# EAGLE design Kintex7_disp_out_hdmi (EAGLE 7.6.0)
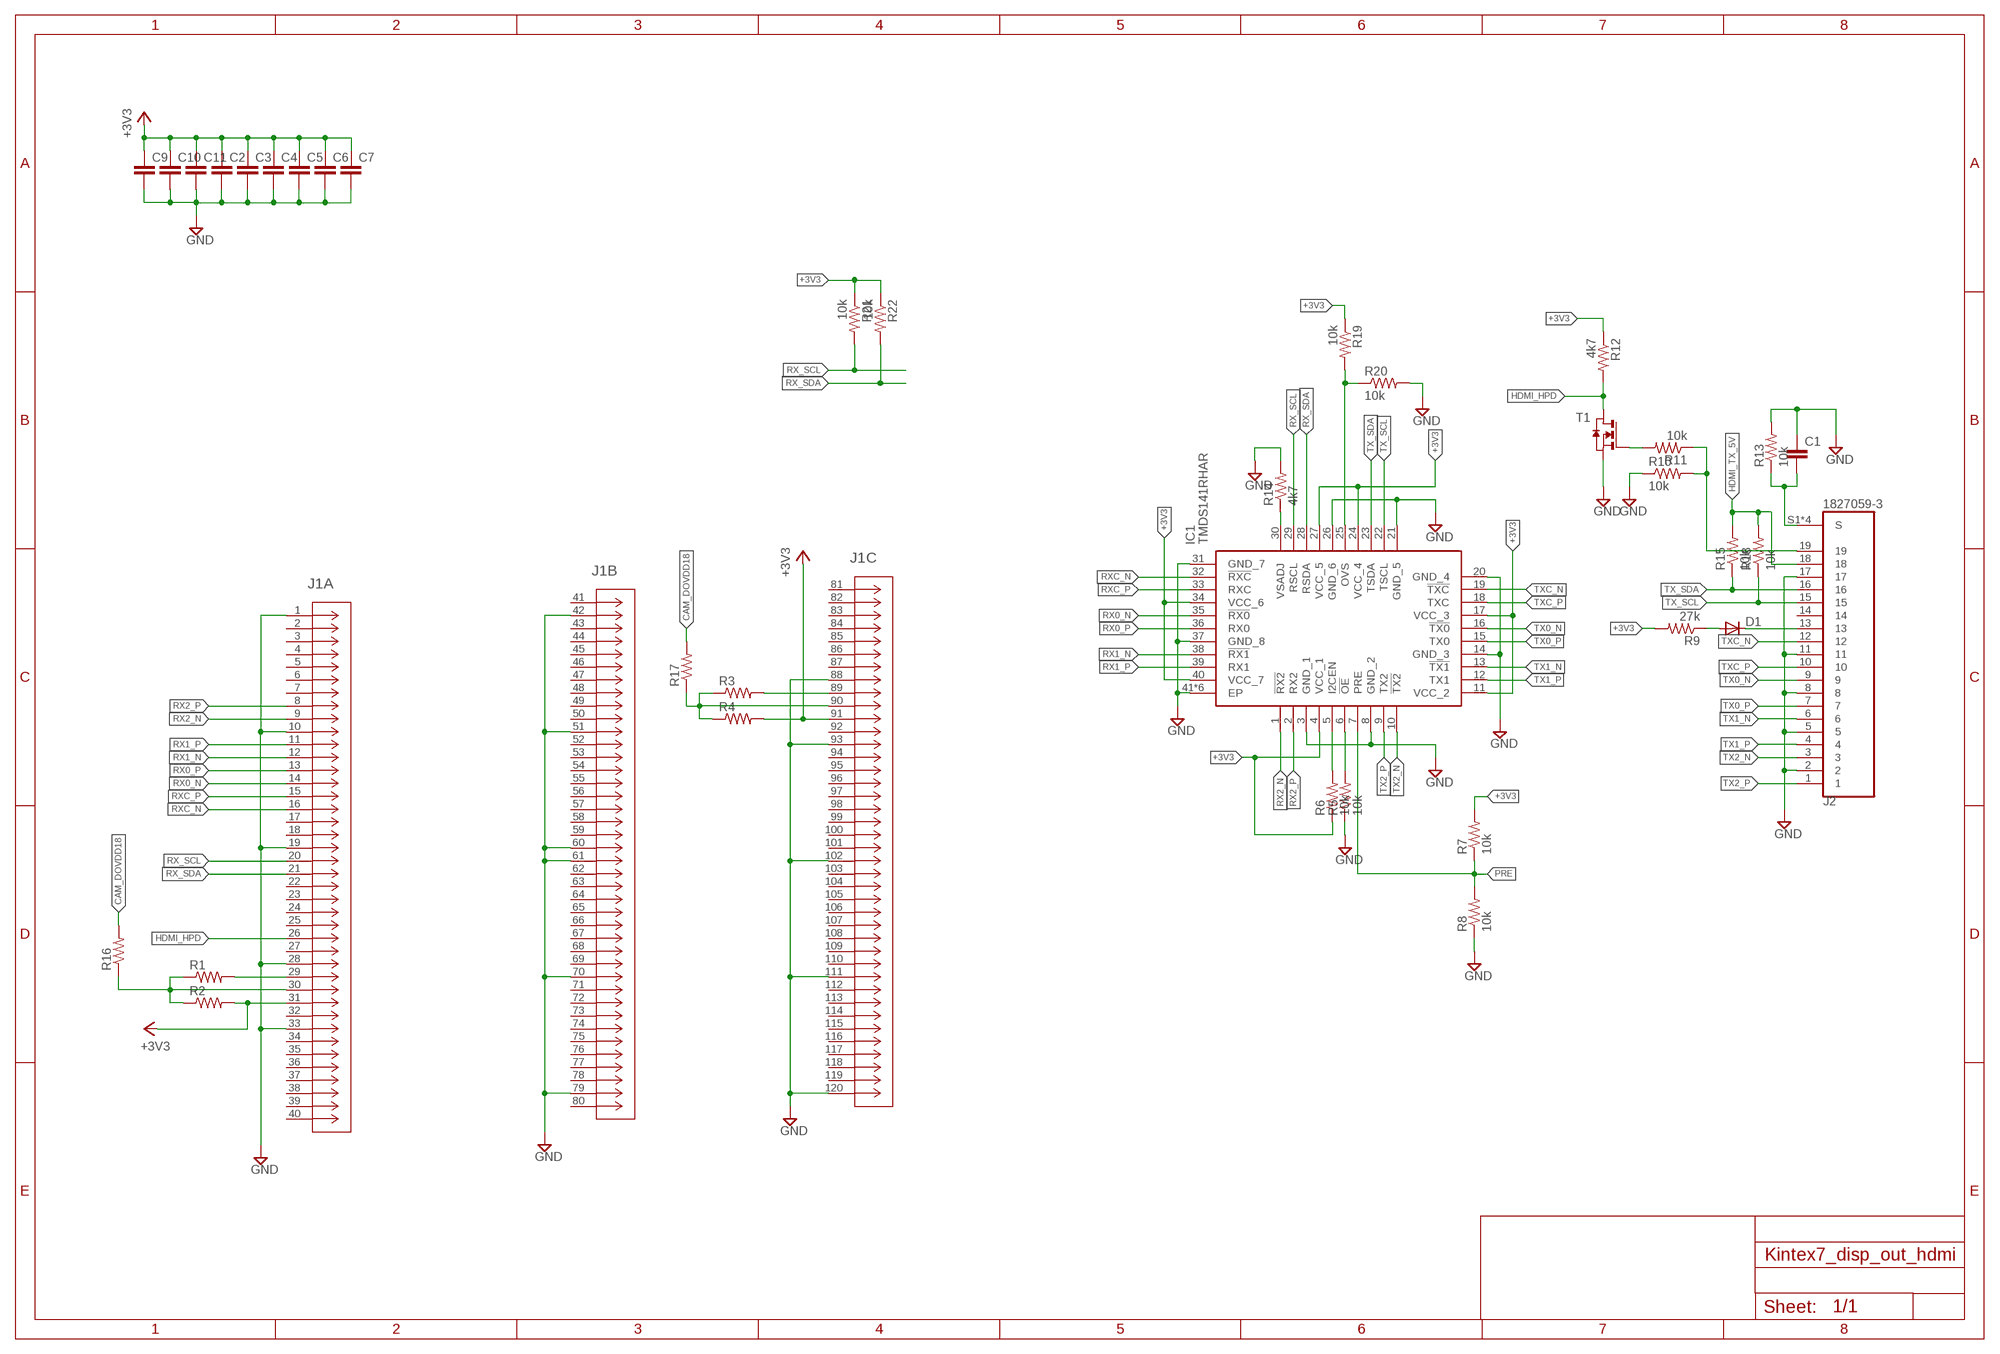
[diagram p0: schematic, sheet 1]

## Parts
C1  C-EUC0603  [C0603]
C2  C-EUC0603  [C0603]
C3  C-EUC0603  [C0603]
C4  C-EUC0603  [C0603]
C5  C-EUC0603  [C0603]
C6  C-EUC0603  [C0603]
C7  C-EUC0603  [C0603]
C9  C-EUC0603  [C0603]
C10  C-EUC0603  [C0603]
C11  C-EUC0603  [C0603]
D1  DIODE-MINIMELF  [MINIMELF]
IC1  TMDS141RHAR  [QFN50P600X600X100-41N]
J1  5177985-5  [CONN_5177985-5]
J2  1827059-3  [TE_1827059-3]
R1  R-US_R0805  [R0805]
R2  R-US_R0805  [R0805]
R3  R-US_R0805  [R0805]
R4  R-US_R0805  [R0805]
R5  10k  R-US_R0805  [R0805]
R6  10k  R-US_R0805  [R0805]
R7  10k  R-US_R0805  [R0805]
R8  10k  R-US_R0805  [R0805]
R9  27k  R-US_R0805  [R0805]
R10  10k  R-US_R0805  [R0805]
R11  10k  R-US_R0805  [R0805]
R12  4k7  R-US_R0805  [R0805]
R13  10k  R-US_R0805  [R0805]
R14  4k7  R-US_R0805  [R0805]
R15  10k  R-US_R0805  [R0805]
R16  R-US_R0805  [R0805]
R17  R-US_R0805  [R0805]
R18  10k  R-US_R0805  [R0805]
R19  10k  R-US_R0805  [R0805]
R20  10k  R-US_R0805  [R0805]
R21  10k  R-US_R0805  [R0805]
R22  10k  R-US_R0805  [R0805]
T1  NMOSSOT23  [SOT-23]

## Nets
+3V3: C2.1 C3.1 C4.1 C5.1 C6.1 C7.1 C9.1 C10.1 C11.1 IC1.4(VCC_1) IC1.11(VCC_2) IC1.17(VCC_3) IC1.24(VCC_4) IC1.27(VCC_5) IC1.34(VCC_6) IC1.40(VCC_7) J1.31 J1.91 R2.2 R4.2 R6.1 R7.2 R9.2 R12.1 R19.1 R21.1 R22.1
CAM_DOVDD18: R16.2 R17.2
GND: C1.1 C2.2 C3.2 C4.2 C5.2 C6.2 C7.2 C9.2 C10.2 C11.2 IC1.3(GND_1) IC1.8(GND_2) IC1.14(GND_3) IC1.20(GND_4) IC1.21(GND_5) IC1.26(GND_6) IC1.31(GND_7) IC1.37(GND_8) IC1.41(EP) IC1.P$1(EP) IC1.P$2(EP) IC1.P$3(EP) IC1.P$4(EP) IC1.P$5(EP) J1.1 J1.10 J1.19 J1.28 J1.33 J1.42 J1.51 J1.60 J1.61 J1.70 J1.79 J1.88 J1.93 J1.102 J1.111 J1.120 J2.2 J2.5 J2.8 J2.11 J2.17 R5.1 R8.1 R10.1 R13.2 R14.2 R20.2 T1.2(S)
HDMI_HPD: J1.26 R12.2 T1.1(D)
HDMI_TX_5V: J2.18 R15.2 R18.2
N$1: D1.A R9.1
N$2: J1.90 R3.1 R4.1 R17.1
N$3: J1.29 R1.2
N$4: J1.89 R3.2
N$6: IC1.6(!OE) R5.2
N$7: IC1.5(I2CEN) R6.2
N$8: D1.C J2.13
N$9: J1.30 R1.1 R2.1 R16.1
N$10: IC1.25(OVS) R19.2 R20.1
N$12: R11.2 T1.3(G)
N$13: C1.2 J2.S1(S) J2.S2(S) J2.S3(S) J2.S4(S) R13.1
N$14: IC1.30(VSADJ) R14.1
N$15: J2.19 R10.2 R11.1
PRE: IC1.7(PRE) R7.1 R8.2
RX0_N: IC1.35(!RX0) J1.14
RX0_P: IC1.36(RX0) J1.13
RX1_N: IC1.38(!RX1) J1.12
RX1_P: IC1.39(RX1) J1.11
RX2_N: IC1.1(!RX2) J1.9
RX2_P: IC1.2(RX2) J1.8
RX_SCL: IC1.29(RSCL) J1.20 R21.2
RX_SDA: IC1.28(RSDA) J1.21 R22.2
RXC_N: IC1.32(!RXC) J1.16
RXC_P: IC1.33(RXC) J1.15
TX0_N: IC1.16(!TX0) J2.9
TX0_P: IC1.15(TX0) J2.7
TX1_N: IC1.13(!TX1) J2.6
TX1_P: IC1.12(TX1) J2.4
TX2_N: IC1.10(!TX2) J2.3
TX2_P: IC1.9(TX2) J2.1
TX_SCL: IC1.22(TSCL) J2.15 R18.1
TX_SDA: IC1.23(TSDA) J2.16 R15.1
TXC_N: IC1.19(!TXC) J2.12
TXC_P: IC1.18(TXC) J2.10
Unconnected: J1.2 J1.3 J1.4 J1.5 J1.6 J1.7 J1.17 J1.18 J1.22 J1.23 J1.24 J1.25 J1.27 J1.32 J1.34 J1.35 J1.36 J1.37 J1.38 J1.39 J1.40 J1.41 J1.43 J1.44 J1.45 J1.46 J1.47 J1.48 J1.49 J1.50 J1.52 J1.53 J1.54 J1.55 J1.56 J1.57 J1.58 J1.59 J1.62 J1.63 J1.64 J1.65 J1.66 J1.67 J1.68 J1.69 J1.71 J1.72 J1.73 J1.74 J1.75 J1.76 J1.77 J1.78 J1.80 J1.81 J1.82 J1.83 J1.84 J1.85 J1.86 J1.87 J1.92 J1.94 J1.95 J1.96 J1.97 J1.98 J1.99 J1.100 J1.101 J1.103 J1.104 J1.105 J1.106 J1.107 J1.108 J1.109 J1.110 J1.112 J1.113 J1.114 J1.115 J1.116 J1.117 J1.118 J1.119 J2.14

## Library data of the parts
C1-C7 C9-C11 = resistor:C-EU: CAPACITOR, European symbol
D1 = diode:DIODE-: DIODE
IC1 = TMDS141RHAR:TMDS141RHAR: HDMI Hider Source: Datasheet <http://uk.rs-online.com/web/p/products/8124195P>; DESCRIPTION: HDMI Hider; HEIGHT: 1mm; MANUFACTURER_NAME: Texas Instruments; MANUFACTURER_PART_NUMBER: TMDS141RHAR; RS_PART_NUMBER: 8124195P; RS_PRICE-STOCK: http://uk.rs-online.com/web/p/products/8124195P
J1 = te_con:5177985-5; BUILT_BY: EMA_UL_Team; MANUFACTURER_PART_NUMBER: 5177985-5; VENDOR: TE Connectivity
J2 = 1827059-3:1827059-3: Emboss Package Hdmi Conn Smt No-Flange t; AVAILABILITY: Unavailable; COMMENT: 1827059-3; DESCRIPTION: EMBOSS PACKAGE HDMI CONN SMT NO-FLANGE T; EU_ROHS_COMPLIANCE: Compliant; MF: TE Connectivity; MP: 1827059-3; PACKAGE: None; PRICE: None; TE_PURCHASE_URL: https://www.te.com/usa-en/product-1827059-3.html?te_bu=Cor&te_type=disp&te_campaign=seda_glo_cor-seda-global-disp-prtnr-fy19-seda-model-bom-cta_sma-317_1&elqCampaignId=32493
R1-R22 = rcl:R-US_: RESISTOR, American symbol
T1 = zetex:NMOSSOT23: MOS FET; OC_FARNELL: unknown; OC_NEWARK: unknown

## Board
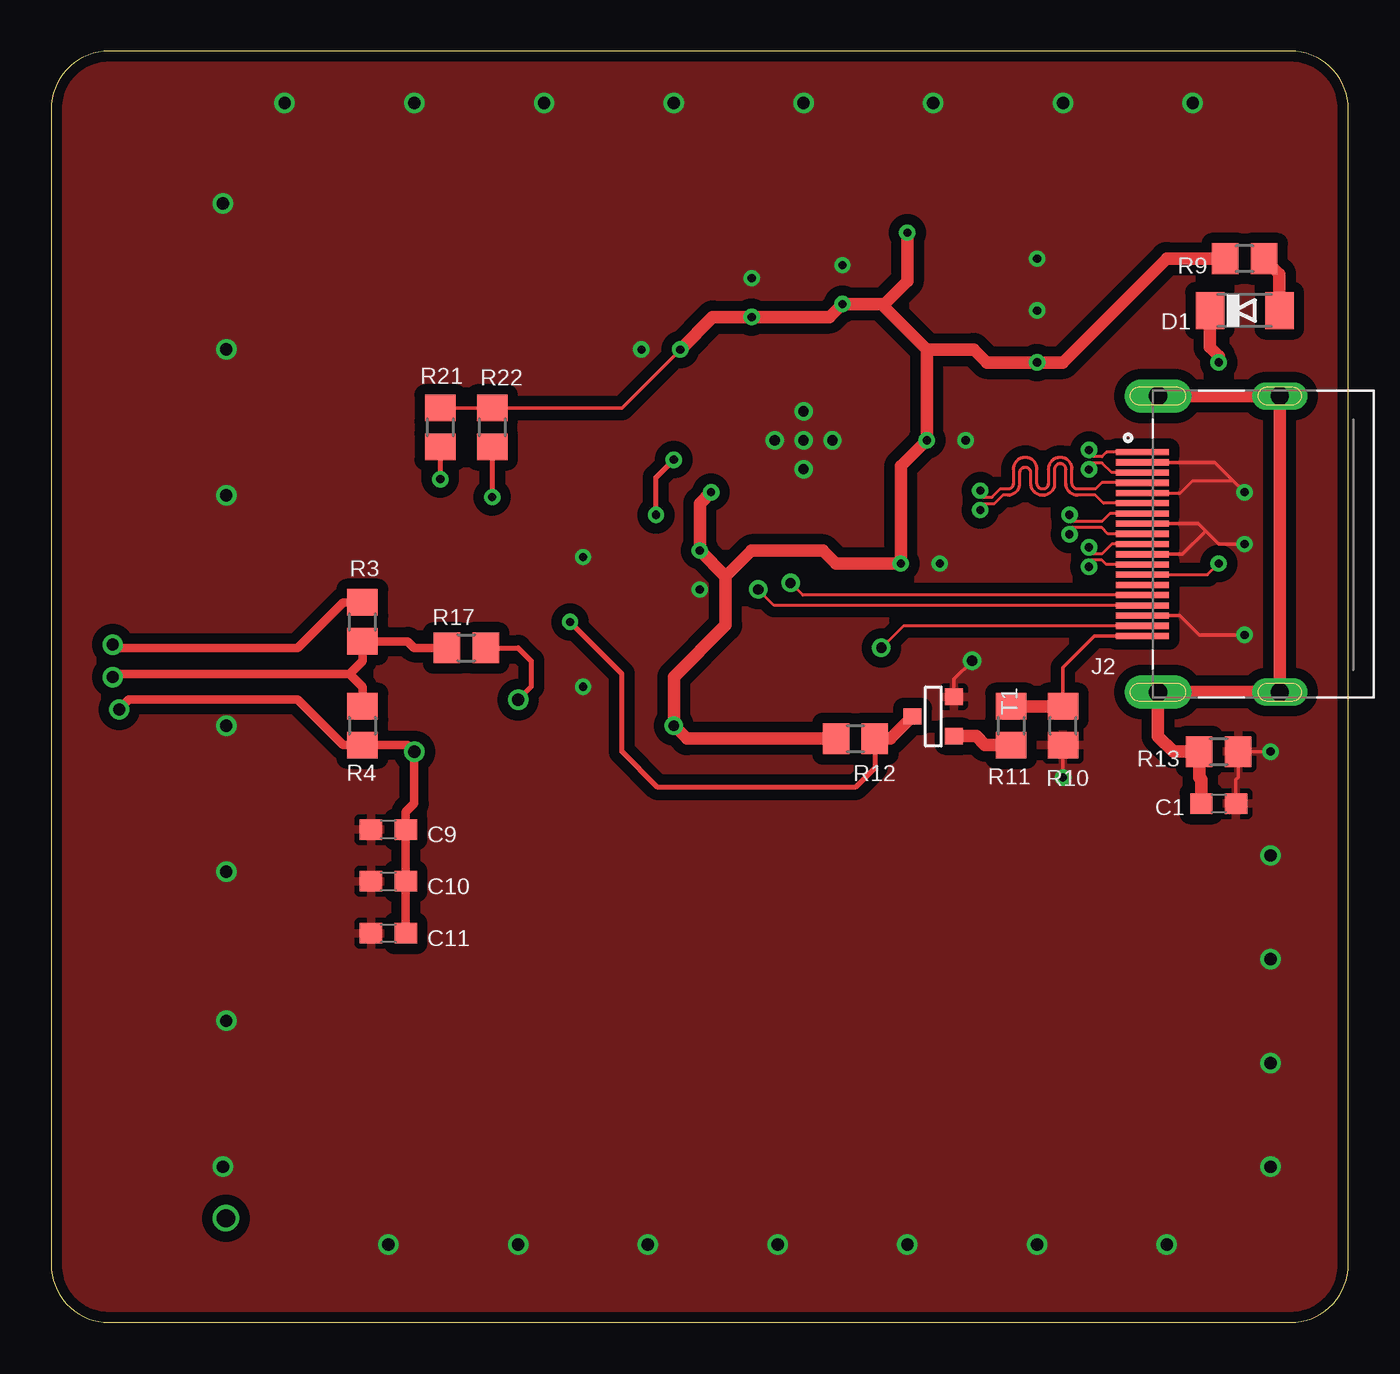
[diagram p1: board, top side]
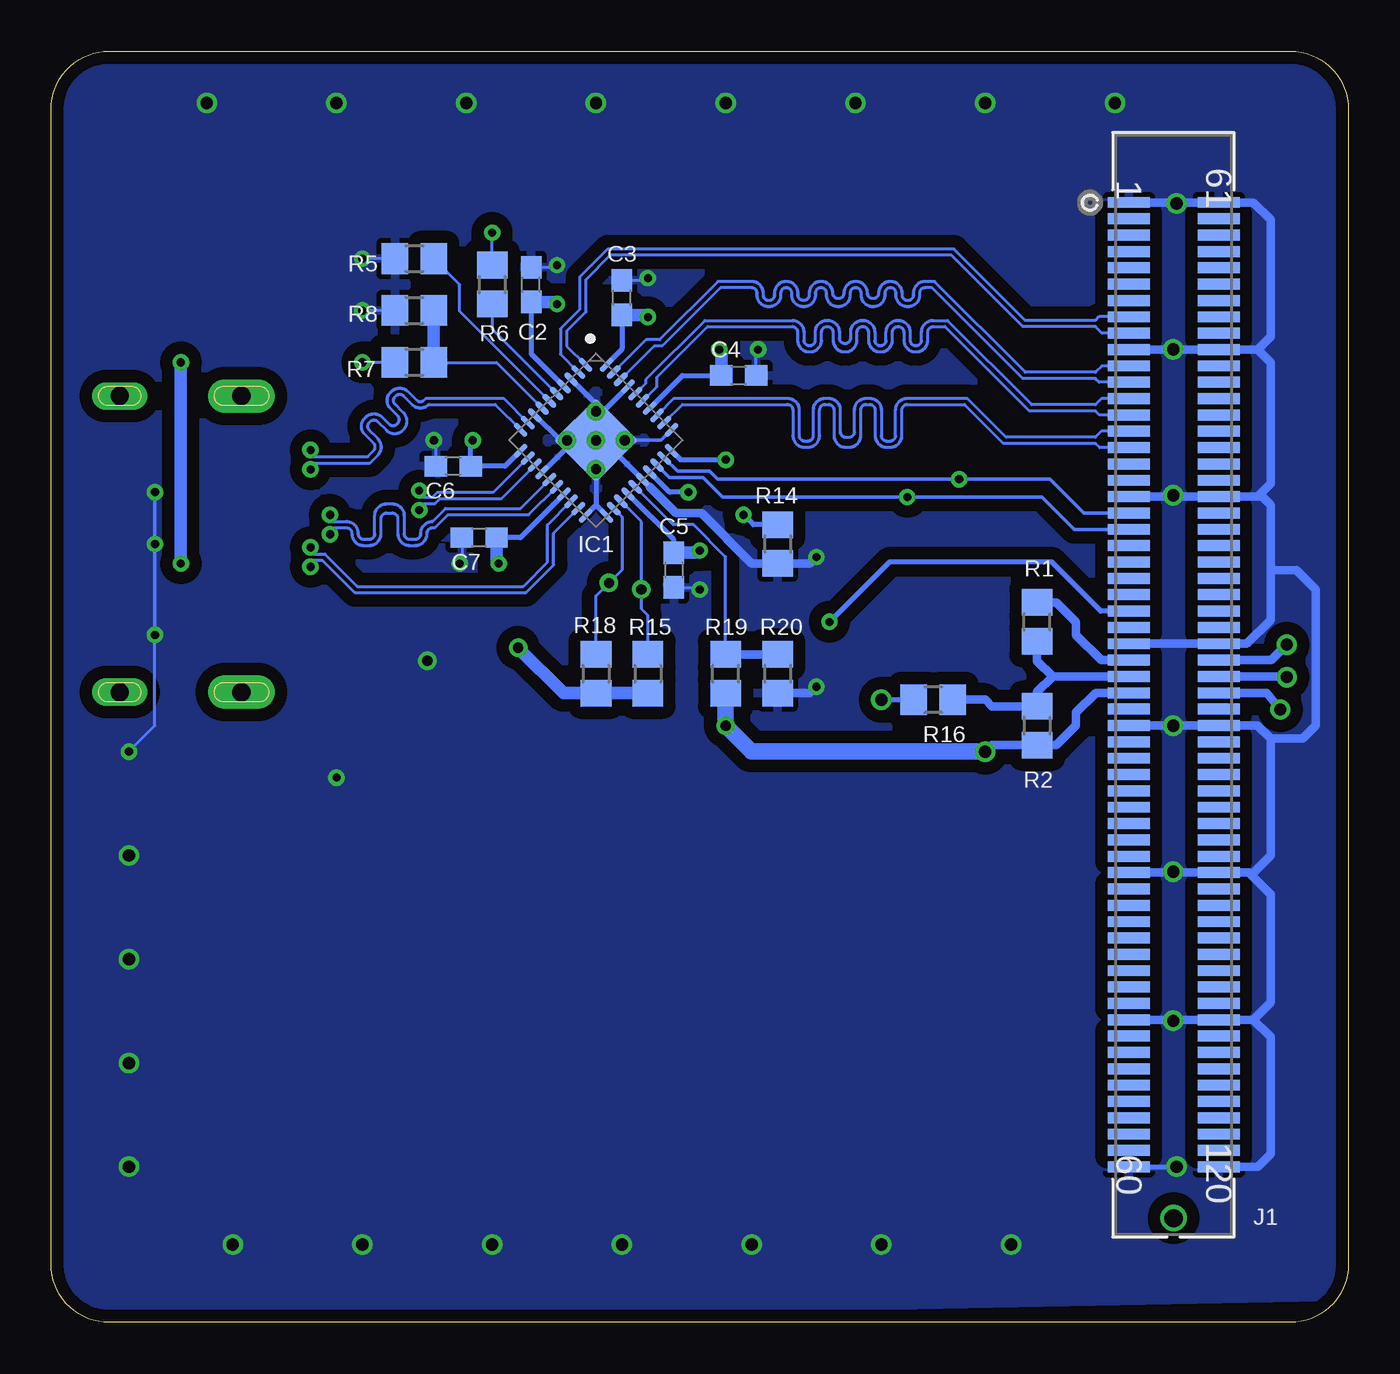
[diagram p2: board, bottom side, seen from below]

Size 63.5 x 62.23 mm. Coordinates in mm from the lower left corner, seen from the top.
Outline: 0,59.39 0,2.84 arc90 2.84,0 60.66,0 arc90 63.5,2.84 63.5,59.39 arc90 60.66,62.23 2.84,62.23 arc90 0,59.39
Copper layers (1*16): Top 0.035mm / dielectric 1.5mm / Bottom 0.035mm
Design rules "2side *": minimum track width 6mil, minimum drill 0.4mm, track to track 6mil, track to pad 6mil, pad to pad 6mil, via to via 6mil, smd to smd 6mil, copper to edge 10mil, drill to drill 10mil, minimum pad ring 0.2mm, minimum via ring 0.2mm, stop-mask expansion 1mil, vias tented up to drill 0.8mm, thermal gap 10mil

### Footprints (pad centres in the part's own frame; a part is rotated, then mirrored left to right if it is on the bottom)
C0603 = smd 1.1 x 1: 1 -0.85,0; 2 0.85,0
MINIMELF = smd 1.4 x 1.8: A 1.7,0; C -1.7,0
QFN50P600X600X100-41N = smd 0.85 x 0.28: 1 -2.975,2.25; 2 -2.975,1.75; 3 -2.975,1.25; 4 -2.975,0.75; 5 -2.975,0.25; 6 -2.975,-0.25; 7 -2.975,-0.75; 8 -2.975,-1.25; 9 -2.975,-1.75; 10 -2.975,-2.25; 21 2.975,-2.25; 22 2.975,-1.75; 23 2.975,-1.25; 24 2.975,-0.75; 25 2.975,-0.25; 26 2.975,0.25; 27 2.975,0.75; 28 2.975,1.25; 29 2.975,1.75; 30 2.975,2.25 | smd 0.28 x 0.85: 11 -2.25,-2.975; 12 -1.75,-2.975; 13 -1.25,-2.975; 14 -0.75,-2.975; 15 -0.25,-2.975; 16 0.25,-2.975; 17 0.75,-2.975; 18 1.25,-2.975; 19 1.75,-2.975; 20 2.25,-2.975; 31 2.25,2.975; 32 1.75,2.975; 33 1.25,2.975; 34 0.75,2.975; 35 0.25,2.975; 36 -0.25,2.975; 37 -0.75,2.975; 38 -1.25,2.975; 39 -1.75,2.975; 40 -2.25,2.975 | smd 2.9 x 2.9: 41 0,0 | drill 0.5 pad 0.8: P$1 -1,1; P$2 1,1; P$3 0,0; P$4 -1,-1; P$5 1,-1
CONN_5177985-5 = smd 0.533 x 2.057: 1 -47.2,-4.4; 2 -46.4,-4.4; 3 -45.6,-4.4; 4 -44.8,-4.4; 5 -44,-4.4; 6 -43.2,-4.4; 7 -42.4,-4.4; 8 -41.6,-4.4; 9 -40.8,-4.4; 10 -40,-4.4; 11 -39.2,-4.4; 12 -38.4,-4.4; 13 -37.6,-4.4; 14 -36.8,-4.4; 15 -36,-4.4; 16 -35.2,-4.4; 17 -34.4,-4.4; 18 -33.6,-4.4; 19 -32.8,-4.4; 20 -32,-4.4; 21 -31.2,-4.4; 22 -30.4,-4.4; 23 -29.6,-4.4; 24 -28.8,-4.4; 25 -28,-4.4; 26 -27.2,-4.4; 27 -26.4,-4.4; 28 -25.6,-4.4; 29 -24.8,-4.4; 30 -24,-4.4; 31 -23.2,-4.4; 32 -22.4,-4.4; 33 -21.6,-4.4; 34 -20.8,-4.4; 35 -20,-4.4; 36 -19.2,-4.4; 37 -18.4,-4.4; 38 -17.6,-4.4; 39 -16.8,-4.4; 40 -16,-4.4; 41 -15.2,-4.4; 42 -14.4,-4.4; 43 -13.6,-4.4; 44 -12.8,-4.4; 45 -12,-4.4; 46 -11.2,-4.4; 47 -10.4,-4.4; 48 -9.6,-4.4; 49 -8.8,-4.4; 50 -8,-4.4; 51 -7.2,-4.4; 52 -6.4,-4.4; 53 -5.6,-4.4; 54 -4.8,-4.4; 55 -4,-4.4; 56 -3.2,-4.4; 57 -2.4,-4.4; 58 -1.6,-4.4; 59 -0.8,-4.4; 60 0,-4.4; 61 -47.2,0; 62 -46.4,0; 63 -45.6,0; 64 -44.8,0; 65 -44,0; 66 -43.2,0; 67 -42.4,0; 68 -41.6,0; 69 -40.8,0; 70 -40,0; 71 -39.2,0; 72 -38.4,0; 73 -37.6,0; 74 -36.8,0; 75 -36,0; 76 -35.2,0; 77 -34.4,0; 78 -33.6,0; 79 -32.8,0; 80 -32,0; 81 -31.2,0; 82 -30.4,0; 83 -29.6,0; 84 -28.8,0; 85 -28,0; 86 -27.2,0; 87 -26.4,0; 88 -25.6,0; 89 -24.8,0; 90 -24,0; 91 -23.2,0; 92 -22.4,0; 93 -21.6,0; 94 -20.8,0; 95 -20,0; 96 -19.2,0; 97 -18.4,0; 98 -17.6,0; 99 -16.8,0; 100 -16,0; 101 -15.2,0; 102 -14.4,0; 103 -13.6,0; 104 -12.8,0; 105 -12,0; 106 -11.2,0; 107 -10.4,0; 108 -9.6,0; 109 -8.8,0; 110 -8,0; 111 -7.2,0; 112 -6.4,0; 113 -5.6,0; 114 -4.8,0; 115 -4,0; 116 -3.2,0; 117 -2.4,0; 118 -1.6,0; 119 -0.8,0; 120 0,0 | drill 0.889 pad 0.889: 121 2.515,-2.21
TE_1827059-3 = smd 0.3 x 2.6: 1 4.5,5; 2 4,5; 3 3.5,5; 4 3,5; 5 2.5,5; 6 2,5; 7 1.5,5; 8 1,5; 9 0.5,5; 10 0,5; 11 -0.5,5; 12 -1,5; 13 -1.5,5; 14 -2,5; 15 -2.5,5; 16 -3,5; 17 -3.5,5; 18 -4,5; 19 -4.5,5 | drill 0.9 pad 1.65 long: S1 7.25,4.24; S2 -7.25,4.24 | drill 0.9 pad 1.35 long: S3 -7.25,-1.72; S4 7.25,-1.72
R0805 = smd 1.3 x 1.5: 1 -0.95,0; 2 0.95,0
SOT-23 = smd 0.787 x 0.889: 1 0.025,-1.016; 2 -0.94,1.016; 3 0.991,1.016

### Placement (x,y rotation side)
C1  57.15,25.4 180 top
C2  40.01,50.8 90 bottom
C3  35.56,50.16 90 bottom
C4  29.84,46.35 0 bottom
C5  33.02,36.83 270 bottom
C6  43.81,41.91 180 bottom
C7  42.55,38.42 180 bottom
C9  16.51,24.13 180 top
C10  16.51,21.59 180 top
C11  16.51,19.05 180 top
D1  58.42,49.53 0 top
IC1  36.83,43.18 315 bottom
J1  6.35,7.62 270 bottom
J2  58.42,38.1 90 top
R1  15.24,34.29 90 bottom
R2  15.24,29.21 270 bottom
R3  15.24,34.29 90 top
R4  15.24,29.21 270 top
R5  45.72,52.07 0 bottom
R6  41.91,50.8 270 bottom
R7  45.72,46.99 180 bottom
R8  45.72,49.53 0 bottom
R9  58.42,52.07 180 top
R10  49.53,29.21 90 top
R11  46.99,29.21 270 top
R12  39.37,28.57 0 top
R13  57.15,27.94 0 top
R14  27.94,38.1 270 bottom
R15  34.29,31.75 270 bottom
R16  20.32,30.48 180 bottom
R17  20.32,33.02 0 top
R18  36.83,31.75 270 bottom
R19  30.48,31.75 90 bottom
R20  27.94,31.75 270 bottom
R21  19.05,43.81 270 top
R22  21.59,43.81 270 top
T1  43.18,29.69 270 top

### Tracks (layer width: path | path; a pad name or v marks a point on that pad's centre or on a via)
+3V3  (via drill 0.4, 0.5, 0.6)
  Top 0.178: v30.8,47.62 27.94,44.77 R22.1 R21.1
  Top 0.406: v3.33,30 3.81,30.48 12.06,30.48 14.29,28.26 R2.2 17.46,28.26 v17.78,27.94 17.78,25.4 17.36,24.98 C9.1 C10.1 C11.1
  Top 0.61: v30.8,47.62 32.38,49.21 v34.29,49.21 38.1,49.21 v38.73,49.85 40.64,49.85 | R9.2 54.61,52.07 49.53,46.99 v48.26,46.99 45.8,46.99 45.16,47.62 42.86,47.62 | 42.86,47.62 v42.86,43.18 41.59,41.91 v41.59,37.15 38.42,37.15 37.78,37.78 34.29,37.78 33.02,36.51 | 40.64,49.85 40.8,49.85 41.91,50.96 v41.91,53.34 | 42.86,47.62 40.64,49.85 | 33.02,36.51 33.02,34.13 30.48,31.59 v30.48,29.21 31.11,28.57 R12.1 | v32.31,40.64 31.75,40.08 v31.75,37.78 33.02,36.51
  Bottom 0.152: R6.1 v41.91,53.34 | R7.2 v48.26,46.99 | 30.7,47.52 v30.8,47.62
  Bottom 0.254: IC1.17 40.53,38.42 C7.1 | C2.1 40.01,47.42 IC1.4 | IC1.34 32.59,46.35 C4.1 | C3.1 35.56,47.63 IC1.40 | C5.1 33.02,38.31 IC1.24 | IC1.11 41.28,41.91 C6.1 42.97,43.08 v42.86,43.18 | v32.31,40.64 33.23,40.64 IC1.27
  Bottom 0.406: J1.91 3.99,30.82 v3.33,30 | J1.31 12.36,30.82 13.34,29.84 13.34,29.21 14.29,28.26 R2.2 17.46,28.26 v17.78,27.94
  Bottom 0.61: C7.1 41.7,37.25 v41.59,37.15 | C2.1 38.84,49.95 v38.73,49.85 | C4.1 30.7,47.52 | C3.1 34.39,49.31 v34.29,49.21 | C5.1 31.85,37.68 v31.75,37.78
  Bottom 0.813: v17.78,27.94 29.21,27.94 v30.48,29.21 R19.1
CAM_DOVDD18  (via drill 0.6)
  Top 0.254: R17.2 22.86,33.02 23.5,32.38 23.5,31.11 v22.86,30.48
  Bottom 0.254: v22.86,30.48 R16.2
GND  (via drill 0.4, 0.5, 0.6)
  Top 0.152: R13.2 v59.69,27.94 | J2.5 55.28,40.6 55.88,41.2 57.86,41.2 58.06,41
  Top 0.178: J2.2 56.96,42.1 58.06,41 v58.42,40.64 | J2.8 56.15,39.1 56.52,38.73 | 56.52,38.73 57.15,38.1 v58.42,38.1 | J2.11 55.38,37.6 56.52,38.73 | J2.17 55.25,34.6 56.2,33.66 v58.42,33.66 | C1.1 58,26.57 58.1,26.67 R13.2 | T1.2 44.2,31.5 v45.09,32.38 | R10.1 v49.53,26.67
  Bottom 0.152: C7.2 43.4,37.25 v43.5,37.15 | R8.1 v48.26,49.53 | R5.1 v48.26,52.07 | C2.2 38.84,51.65 v38.73,51.75 | C4.2 29,47.52 v28.89,47.62 | C3.2 34.39,51.02 v34.29,51.12 | C5.2 31.85,35.98 v31.75,35.88 | v59.69,27.94 58.42,29.21 v58.42,33.66 | C6.2 44.66,43.08 v44.77,43.18
  Bottom 0.178: v58.42,40.64 v58.42,38.1 v58.42,33.66 | 38.24,42.83 IC1.P$4 38.6,43.18 | IC1.P$5 36.83,40 | 36.83,44.95 IC1.P$1 36.48,44.59 | IC1.P$2 33.65,43.18 IC1.31 | IC1.P$3 36.48,43.18 | 34.21,40.91 IC1.26
  Bottom 0.254: J1.60 v8.41,7.62 | v8.41,7.62 | 38.24,42.83 IC1.14 | 38.6,43.18 IC1.8 | 36.83,40 IC1.20 | IC1.P$5 36.83,40 | 36.83,40 IC1.21 | 36.83,44.95 IC1.3 | 36.48,44.59 IC1.37 | 36.48,43.18 IC1.26
  Bottom 0.406: 4.66,14.82 3.81,13.97 3.81,8.26 4.45,7.62 J1.120 | 4.76,21.91 4.88,22.02 J1.102 8.53,22.02 v8.57,22.07 8.62,22.02 J1.42 | 4.76,21.91 3.81,20.95 3.81,15.67 4.66,14.82 | J1.28 J1.88 4.96,33.22 3.81,34.37 3.81,36.83 | 3.81,28.57 3.81,22.86 4.76,21.91 | 4.45,40.42 J1.79 8.51,40.42 v8.57,40.48 8.63,40.42 J1.19 | 4.45,40.42 4.22,40.42 3.81,40.01 3.81,36.83 | 4.44,47.62 J1.70 v8.57,47.62 v8.58,47.62 J1.10 | 4.44,47.62 3.81,46.99 3.81,41.05 4.45,40.42 | 4.44,47.62 3.81,48.25 3.81,53.98 4.66,54.82 J1.61 8.36,54.82 v8.41,54.77 8.46,54.82 J1.1 | J1.33 8.58,29.22 v8.57,29.21 v8.56,29.22 J1.93 4.46,29.22 3.81,28.57 | 4.66,14.82 J1.111 8.52,14.82 v8.57,14.76 8.63,14.82 J1.51 | 3.81,36.83 2.54,36.83 1.59,35.88 1.59,29.21 2.22,28.57 3.81,28.57 | R20.2 26.35,30.8 v26.04,31.11 | v26.04,37.47 26.35,37.15 R14.2 29.21,37.15 31.67,39.61 32.91,39.61 34.21,40.91
  other vias: 16.51,3.81 22.86,3.81 29.21,3.81 35.56,3.81 41.91,3.81 48.26,3.81 17.78,59.69 24.13,59.69 30.48,59.69 36.83,59.69 43.18,59.69 49.53,59.69 54.61,3.81 55.88,59.69 11.43,59.69 59.69,22.86 59.69,17.78 59.69,12.7 59.69,7.62
  pour Top (isolate 0.508): 0,62.23 63.5,62.23 64.77,-1.27 0,0
  pour Bottom (isolate 0.61): -1.27,63.5 63.5,62.23 63.5,0 -1.27,1.27
HDMI_HPD  (via drill 0.4)
  Top 0.254: R12.2 40.32,27.14 39.37,26.19 29.69,26.19 27.94,27.94 27.94,31.75 v25.4,34.29
  Top 0.61: R12.2 41.08,28.57 T1.1
  Bottom 0.254: v25.4,34.29 22.46,37.23 14.53,37.23 12.12,34.82 J1.26
HDMI_TX_5V  (via drill 0.5)
  Top 0.152: v40.64,33.02 41.72,34.1 J2.18
  Bottom 0.61: R15.2 R18.2 38.42,30.8 v40.64,33.02
N$1
  Top 0.61: D1.A 60.12,51.32 R9.1
N$2  (via drill 0.6)
  Top 0.406: 14.61,31.75 15.24,32.38 R3.1 17.46,33.34 17.78,33.02 R17.1 | R4.1 15.24,31.11 14.61,31.75 | 14.61,31.75 3.17,31.75 v3.02,31.59
  Bottom 0.406: J1.90 3.04,31.62 v3.02,31.59
N$3
  Bottom 0.406: J1.29 12.1,32.42 13.34,33.66 13.34,34.29 14.29,35.24 R1.2
N$4  (via drill 0.6)
  Top 0.406: R3.2 14.29,35.24 12.06,33.02 3.17,33.02 v3.02,33.18
  Bottom 0.406: J1.89 3.77,32.42 v3.02,33.18
N$6
  Bottom 0.152: IC1.6 43.5,49.49 43.5,50.8 R5.2
N$7
  Bottom 0.152: R6.2 41.91,48.61 IC1.5
N$8  (via drill 0.4)
  Top 0.152: J2.13 56.6,36.6 v57.15,37.15
  Top 0.61: v57.15,46.99 57.15,47.31 56.72,47.74 D1.C
  Bottom 0.61: v57.15,37.15 v57.15,46.99
N$9
  Bottom 0.406: J1.30 14.47,31.62 | 14.47,31.62 15.24,32.38 R1.1 | 14.47,31.62 15.24,30.86 R2.1 17.46,30.16 17.78,30.48 R16.1
N$10
  Bottom 0.152: R19.2 30.48,37.47 32.07,39.05 33.06,39.05 IC1.25
  Bottom 0.406: R19.2 R20.1
N$12
  Top 0.61: R11.2 45.72,28.26 45.28,28.7 T1.3
N$13
  Top 0.178: 56.2,26.67
  Top 0.61: 56.2,26.67 R13.1 54.93,27.94 54.18,28.69 J2.S2 J2.S3 J2.S4 J2.S1 | C1.2 56.3,26.57 56.2,26.67
N$14  (via drill 0.4)
  Top 0.254: v29.61,39.53 29.61,41.35 v30.48,42.23
  Bottom 0.152: 33.09,42.62 IC1.30
  Bottom 0.254: R14.1 29.13,39.05 v29.61,39.53 | IC1.30 32.7,42.23 v30.48,42.23
N$15
  Top 0.178: J2.19 51.06,33.6 49.53,32.07 R10.2
  Top 0.61: R10.2 R11.1
PRE
  Bottom 0.152: R7.1 41.7,46.99 IC1.7
  Bottom 0.61: R7.1 R8.2
RX0_N
  Bottom 0.152: J1.14 12.19,44.42 12.38,44.62 15.62,44.62 19.75,48.74 20.32,48.74 arc-90 20.59,48.48 20.59,48.08 arc90 21.16,47.51 21.19,47.51 arc90 21.76,48.08 21.76,48.48 arc-90 22.02,48.74 22.05,48.74 arc-90 22.32,48.48 22.32,48.08 arc90 22.89,47.51 22.92,47.51 arc90 23.49,48.08 23.49,48.48 arc-90 23.76,48.74 23.79,48.74 arc-90 24.05,48.48 24.05,48.08 arc90 24.63,47.51 24.66,47.51 arc90 25.23,48.08 25.23,48.48 arc-90 25.49,48.74 25.52,48.74 arc-90 25.79,48.48 25.79,48.08 arc90 26.36,47.51 26.39,47.51 arc90 26.96,48.08 26.96,48.48 arc-90 27.23,48.74 31.37,48.74 33.87,46.25 33.87,45.79 IC1.35
RX0_P
  Bottom 0.152: J1.13 12.08,45.22 12.38,44.92 15.49,44.92 19.62,49.05 20.32,49.05 arc-90 20.89,48.48 20.89,48.08 arc90 21.16,47.81 21.19,47.81 arc90 21.45,48.08 21.45,48.48 arc-90 22.02,49.05 22.05,49.05 arc-90 22.62,48.48 22.62,48.08 arc90 22.89,47.81 22.92,47.81 arc90 23.19,48.08 23.19,48.48 arc-90 23.76,49.05 23.79,49.05 arc-90 24.36,48.48 24.36,48.19 arc90 24.63,47.92 24.66,47.92 arc90 24.92,48.19 24.92,48.48 arc-90 25.49,49.05 25.52,49.05 arc-90 26.09,48.48 26.09,48.08 arc90 26.36,47.81 26.39,47.81 arc90 26.66,48.08 26.66,48.48 arc-90 27.23,49.05 31.5,49.05 34.4,46.15 34.4,45.97 IC1.36
RX1_N
  Bottom 0.152: J1.12 12.2,46.02 12.38,46.2 15.94,46.2 20.38,50.65 20.72,50.65 arc-90 20.99,50.38 20.99,50.29 arc90 21.56,49.72 21.57,49.72 arc90 22.15,50.29 22.15,50.38 arc-90 22.41,50.65 22.42,50.65 arc-90 22.69,50.38 22.69,50.29 arc90 23.26,49.72 23.27,49.72 arc90 23.84,50.29 23.84,50.38 arc-90 24.11,50.65 24.12,50.65 arc-90 24.39,50.38 24.39,50.29 arc90 24.96,49.72 24.97,49.72 arc90 25.54,50.29 25.54,50.38 arc-90 25.81,50.65 25.82,50.65 arc-90 26.09,50.38 26.09,50.29 arc90 26.66,49.72 26.67,49.72 arc90 27.24,50.29 27.24,50.38 arc-90 27.51,50.65 27.52,50.65 arc-90 27.79,50.38 27.79,50.29 arc90 28.36,49.72 28.37,49.72 arc90 28.94,50.29 28.94,50.38 arc-90 29.21,50.65 30.73,50.65 33.59,47.79 33.99,47.79 IC1.38
RX1_P
  Bottom 0.152: J1.11 12.07,46.82 12.38,46.51 15.81,46.51 20.26,50.95 20.72,50.95 arc-90 21.3,50.38 21.3,50.29 arc90 21.56,50.02 21.57,50.02 arc90 21.84,50.29 21.84,50.38 arc-90 22.41,50.95 22.42,50.95 arc-90 23,50.38 arc90 23.26,50.11 23.27,50.11 arc90 23.54,50.38 arc-90 24.11,50.95 24.12,50.95 arc-90 24.7,50.38 arc90 24.96,50.11 24.97,50.11 arc90 25.24,50.38 arc-90 25.81,50.95 25.82,50.95 arc-90 26.39,50.38 26.39,50.29 arc90 26.66,50.02 26.67,50.02 arc90 26.94,50.29 26.94,50.38 arc-90 27.51,50.95 27.52,50.95 arc-90 28.09,50.38 28.09,50.29 arc90 28.36,50.02 28.37,50.02 arc90 28.64,50.29 28.64,50.38 arc-90 29.21,50.95 30.86,50.95 33.72,48.09 34.39,48.09 IC1.39
RX2_N
  Bottom 0.152: IC1.1 38.27,47.8 38.27,48.51 37.31,49.47 37.31,51.05 36.13,52.23 19.43,52.23 15.94,48.74 12.38,48.74 12.06,48.42 J1.9
RX2_P
  Bottom 0.152: IC1.2 38.57,47.4 38.57,48.64 37.62,49.59 37.62,51.18 36.26,52.54 19.3,52.54 15.81,49.05 12.38,49.05 12.21,49.22 J1.8
RX_SCL  (via drill 0.4)
  Top 0.254: R21.2 v19.05,41.27
  Bottom 0.178: IC1.29 32.85,41.67 31.27,41.67 30.88,41.27 v19.05,41.27 14.61,41.27 12.95,39.62 J1.20
RX_SDA  (via drill 0.4)
  Top 0.254: R22.2 v21.59,40.4
  Bottom 0.178: IC1.28 33.24,41.35 31.59,41.35 30.64,40.4 v21.59,40.4 15,40.4 13.42,38.82 J1.21
RXC_N
  Bottom 0.152: J1.16 12.18,42.82 12.38,43.03 16.89,43.03 18.8,44.93 21.59,44.93 arc-90 21.86,44.67 21.86,43.41 arc90 22.43,42.84 22.6,42.84 arc90 23.17,43.41 23.17,44.67 arc-90 23.43,44.93 23.6,44.93 arc-90 23.87,44.67 23.87,43.41 arc90 24.44,42.84 24.61,42.84 arc90 25.18,43.41 25.18,44.67 arc-90 25.45,44.93 25.61,44.93 arc-90 25.88,44.67 25.88,43.41 arc90 26.45,42.84 26.62,42.84 arc90 27.19,43.41 27.19,44.67 arc-90 27.46,44.93 32.6,44.93 IC1.32
RXC_P
  Bottom 0.152: J1.15 12.1,43.62 12.38,43.33 16.76,43.33 18.67,45.24 21.59,45.24 arc-90 22.16,44.67 22.16,43.41 arc90 22.43,43.15 22.6,43.15 arc90 22.86,43.41 22.86,44.67 arc-90 23.43,45.24 23.6,45.24 arc-90 24.17,44.67 24.17,43.6 arc90 24.44,43.33 24.61,43.33 arc90 24.88,43.6 24.88,44.67 arc-90 25.45,45.24 25.61,45.24 arc-90 26.19,44.67 26.19,43.41 arc90 26.45,43.15 26.62,43.15 arc90 26.89,43.41 26.89,44.67 arc-90 27.46,45.24 33.01,45.24 IC1.33
TX0_N  (via drill 0.4)
  Top 0.152: J2.9 51.73,38.6 51.44,38.9 49.85,38.9 v49.85,38.58
  Bottom 0.152: v49.85,38.58 49.85,38.9 49.05,38.9 arc90 48.78,38.63 48.78,38.6 arc-90 48.21,38.03 47.92,38.03 arc-90 47.35,38.6 47.35,39.35 arc90 47.08,39.62 46.79,39.62 arc90 46.53,39.35 46.53,38.6 arc-90 45.96,38.03 45.67,38.03 arc-90 45.1,38.6 45.1,38.63 arc90 44.83,38.9 44.7,38.9 44.07,39.53 40.12,39.53 IC1.16
TX0_P  (via drill 0.4)
  Top 0.152: J2.7 51.83,39.6 51.44,39.2 49.85,39.2 v49.85,39.53
  Bottom 0.152: v49.85,39.53 49.85,39.2 49.05,39.2 arc90 48.47,38.63 48.47,38.6 arc-90 48.21,38.34 47.92,38.34 arc-90 47.65,38.6 47.65,39.5 arc90 47.08,40.07 46.79,40.07 arc90 46.22,39.5 46.22,38.6 arc-90 45.96,38.34 45.67,38.34 arc-90 45.4,38.6 45.4,38.63 arc90 44.83,39.2 44.2,39.84 40.52,39.84 IC1.15
TX1_N  (via drill 0.4)
  Top 0.152: J2.6 51.51,40.1 51.12,40.49 50.24,40.49 arc-90 49.67,41.06 49.67,41.77 arc90 49.4,42.03 49.38,42.03 arc90 49.12,41.77 49.12,41.06 arc-90 48.55,40.49 48.53,40.49 arc-90 47.96,41.06 47.96,41.58 arc90 47.69,41.85 47.67,41.85 arc90 47.4,41.58 47.4,41.06 arc-90 46.83,40.49 46.58,40.49 46.18,40.09 45.48,40.09 v45.48,39.77
  Bottom 0.152: v45.48,39.77 45.48,40.09 44.7,40.09 44.47,40.33 41.45,40.33 IC1.13
TX1_P  (via drill 0.4)
  Top 0.152: J2.4 51.42,41.1 51.12,40.79 50.24,40.79 arc-90 49.98,41.06 49.98,41.77 arc90 49.4,42.34 49.38,42.34 arc90 48.81,41.77 48.81,41.06 arc-90 48.55,40.79 48.53,40.79 arc-90 48.26,41.06 48.26,41.77 arc90 47.69,42.34 47.67,42.34 arc90 47.1,41.77 47.1,41.06 arc-90 46.83,40.79 46.45,40.79 46.05,40.4 45.48,40.4 v45.48,40.72
  Bottom 0.152: v45.48,40.72 45.48,40.4 44.83,40.4 44.59,40.63 41.85,40.63 IC1.12
TX2_N  (via drill 0.4)
  Top 0.152: J2.3 51.91,41.6 51.44,42.08 50.8,42.08 v50.8,41.75
  Bottom 0.152: v50.8,41.75 50.8,42.08 47.88,42.08 47.5,42.45 arc-90 47.5,43.26 47.92,43.68 arc90 47.92,44.06 47.89,44.09 arc90 47.51,44.09 47.09,43.67 arc-90 46.28,43.67 46.24,43.71 arc-90 46.24,44.52 46.66,44.94 arc90 46.66,45.32 46.63,45.35 arc90 46.25,45.35 45.83,44.93 arc-90 45.02,44.93 41.77,44.93 IC1.10
TX2_P  (via drill 0.4)
  Top 0.152: J2.1 51.66,42.6 51.44,42.38 50.8,42.38 v50.8,42.7
  Bottom 0.152: v50.8,42.7 50.8,42.38 48.01,42.38 47.72,42.67 arc-90 47.72,43.04 48.14,43.47 arc90 48.14,44.27 48.1,44.31 arc90 47.29,44.31 46.95,43.97 arc-90 46.58,43.97 46.54,44.01 arc-90 46.54,44.38 46.88,44.72 arc90 46.88,45.53 46.84,45.57 arc90 46.03,45.57 45.62,45.15 arc-90 45.24,45.15 45.15,45.24 41.36,45.24 IC1.9
TX_SCL  (via drill 0.5)
  Top 0.152: J2.15 36.79,35.6 v36.2,36.2
  Bottom 0.152: IC1.22 35.56,39.44 35.56,36.83 v36.2,36.2 36.83,35.56 R18.1
TX_SDA  (via drill 0.5)
  Top 0.152: J2.16 35.38,35.1 v34.61,35.88
  Bottom 0.152: IC1.23 34.61,39.19 v34.61,35.88 34.61,34.92 34.29,34.61 R15.1
TXC_N  (via drill 0.4)
  Top 0.152: J2.12 51.65,37.1 51.44,37.31 50.8,37.31 v50.8,36.99
  Bottom 0.152: v50.8,36.99 50.8,37.31 50.23,37.31 48.64,35.73 40.26,35.73 38.9,37.08 38.9,38.63 IC1.19
TXC_P  (via drill 0.4)
  Top 0.152: J2.10 51.92,38.1 51.44,37.62 50.8,37.62 v50.8,37.94
  Bottom 0.152: v50.8,37.94 50.8,37.62 50.1,37.62 48.51,36.03 40.39,36.03 39.2,37.21 39.2,39.04 IC1.18